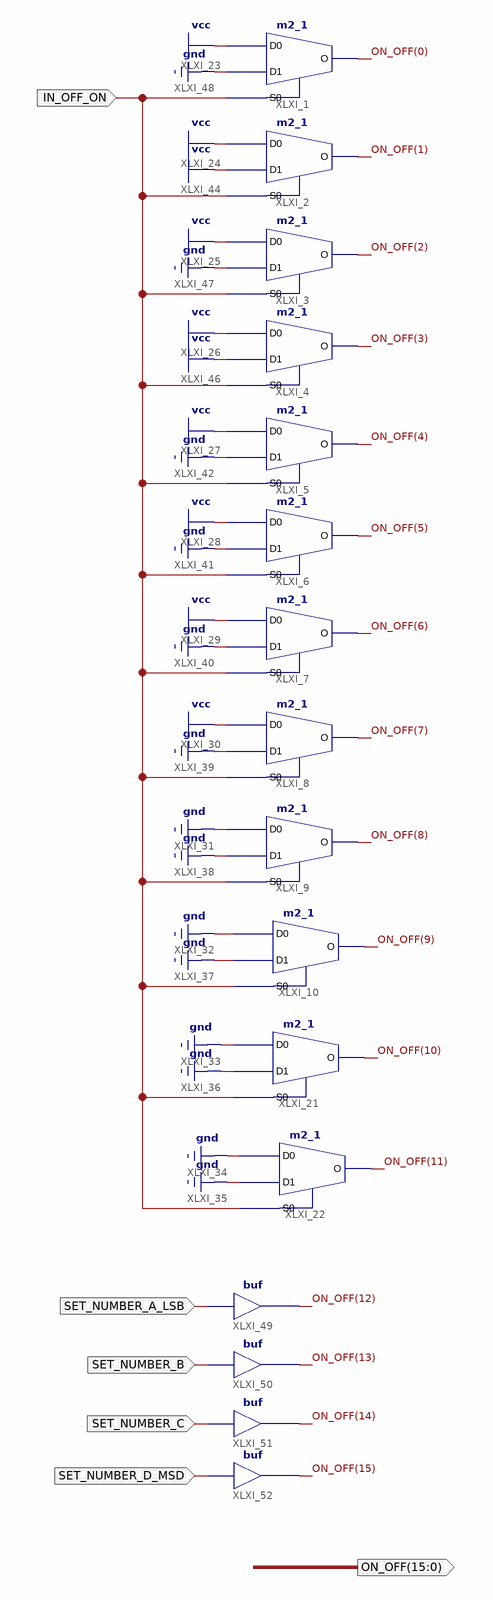
[diagram p0: schematic sheet 1]
// Xilinx ISE schematic ON_OFF_NUMBER.sch (spartan6) as structural Verilog: 16 symbols, 6 ports
module ON_OFF_NUMBER (
  input  IN_OFF_ON,
  input  SET_NUMBER_A_LSB,
  input  SET_NUMBER_B,
  input  SET_NUMBER_C,
  input  SET_NUMBER_D_MSD,
  output [15:0] ON_OFF
);

  m2_1 XLXI_1 (.D0(1'b1), .D1(1'b0), .S0(IN_OFF_ON), .O(ON_OFF[0]));
  m2_1 XLXI_2 (.D0(1'b1), .D1(1'b1), .S0(IN_OFF_ON), .O(ON_OFF[1]));
  m2_1 XLXI_3 (.D0(1'b1), .D1(1'b0), .S0(IN_OFF_ON), .O(ON_OFF[2]));
  m2_1 XLXI_4 (.D0(1'b1), .D1(1'b1), .S0(IN_OFF_ON), .O(ON_OFF[3]));
  m2_1 XLXI_5 (.D0(1'b1), .D1(1'b0), .S0(IN_OFF_ON), .O(ON_OFF[4]));
  m2_1 XLXI_6 (.D0(1'b1), .D1(1'b0), .S0(IN_OFF_ON), .O(ON_OFF[5]));
  m2_1 XLXI_7 (.D0(1'b1), .D1(1'b0), .S0(IN_OFF_ON), .O(ON_OFF[6]));
  m2_1 XLXI_8 (.D0(1'b1), .D1(1'b0), .S0(IN_OFF_ON), .O(ON_OFF[7]));
  m2_1 XLXI_9 (.D0(1'b0), .D1(1'b0), .S0(IN_OFF_ON), .O(ON_OFF[8]));
  m2_1 XLXI_10 (.D0(1'b0), .D1(1'b0), .S0(IN_OFF_ON), .O(ON_OFF[9]));
  m2_1 XLXI_21 (.D0(1'b0), .D1(1'b0), .S0(IN_OFF_ON), .O(ON_OFF[10]));
  m2_1 XLXI_22 (.D0(1'b0), .D1(1'b0), .S0(IN_OFF_ON), .O(ON_OFF[11]));
  buf XLXI_49 (ON_OFF[12], SET_NUMBER_A_LSB);
  buf XLXI_50 (ON_OFF[13], SET_NUMBER_B);
  buf XLXI_51 (ON_OFF[14], SET_NUMBER_C);
  buf XLXI_52 (ON_OFF[15], SET_NUMBER_D_MSD);
endmodule
